# Altium schematic sheet Proximity_Sense.schdoc
size 88 x 69 mm
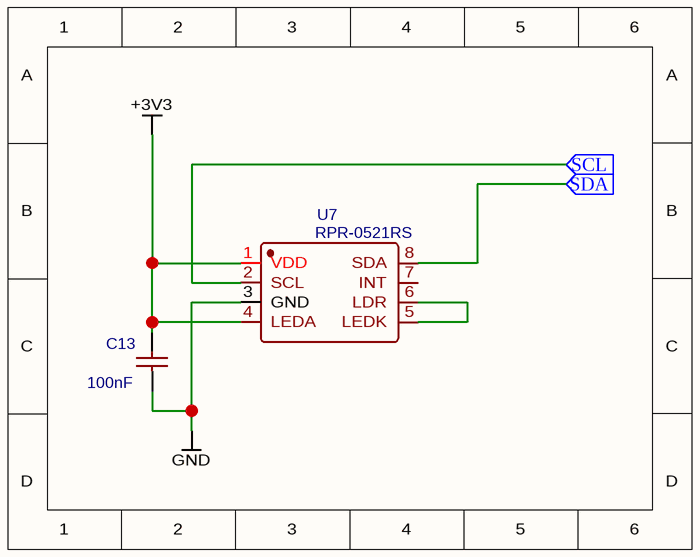
[diagram p0: Proximity_Sense.schdoc]

## Parts
C13  100nF  [C0603]
U7  RPR-0521RS  [SENSOR-SMD_RPR-0521RS]

## Ports
SCL (in), SDA (in)

## Nets
+3V3: C13.2 U7.1(VDD) U7.4(LEDA)
GND: C13.1 U7.3(GND)
SCL: U7.2(SCL) ; port SCL
SDA: U7.8(SDA) ; port SDA
NetU7_5: U7.5(LEDK) U7.6(LDR)

Not connected (* = marked no-connect by the designer): U7 7(INT)

## Library data of the parts
C13 = 100nF: BOM_Manufacturer: SAMSUNG; BOM_Manufacturer Part: CL10B104KO8NNNC; nameAlias: Capacitance; BOM_Supplier: LCSC; BOM_Supplier Part: C66501; BOM_JLCPCB Part Class: Extended Part; spicePre: C; spiceSymbolName: CL10B104KO8NNNC
U7 = RPR-0521RS: BOM_Manufacturer: ROHM(罗姆); Contributor: LCSC; BOM_Supplier: LCSC; BOM_Supplier Part: C509781; BOM_Manufacturer Part: RPR-0521RS; BOM_JLCPCB Part Class: Extended Part; spicePre: U; spiceSymbolName: RPR-0521RS